# EAGLE design opd tester (EAGLE 9.5.2)
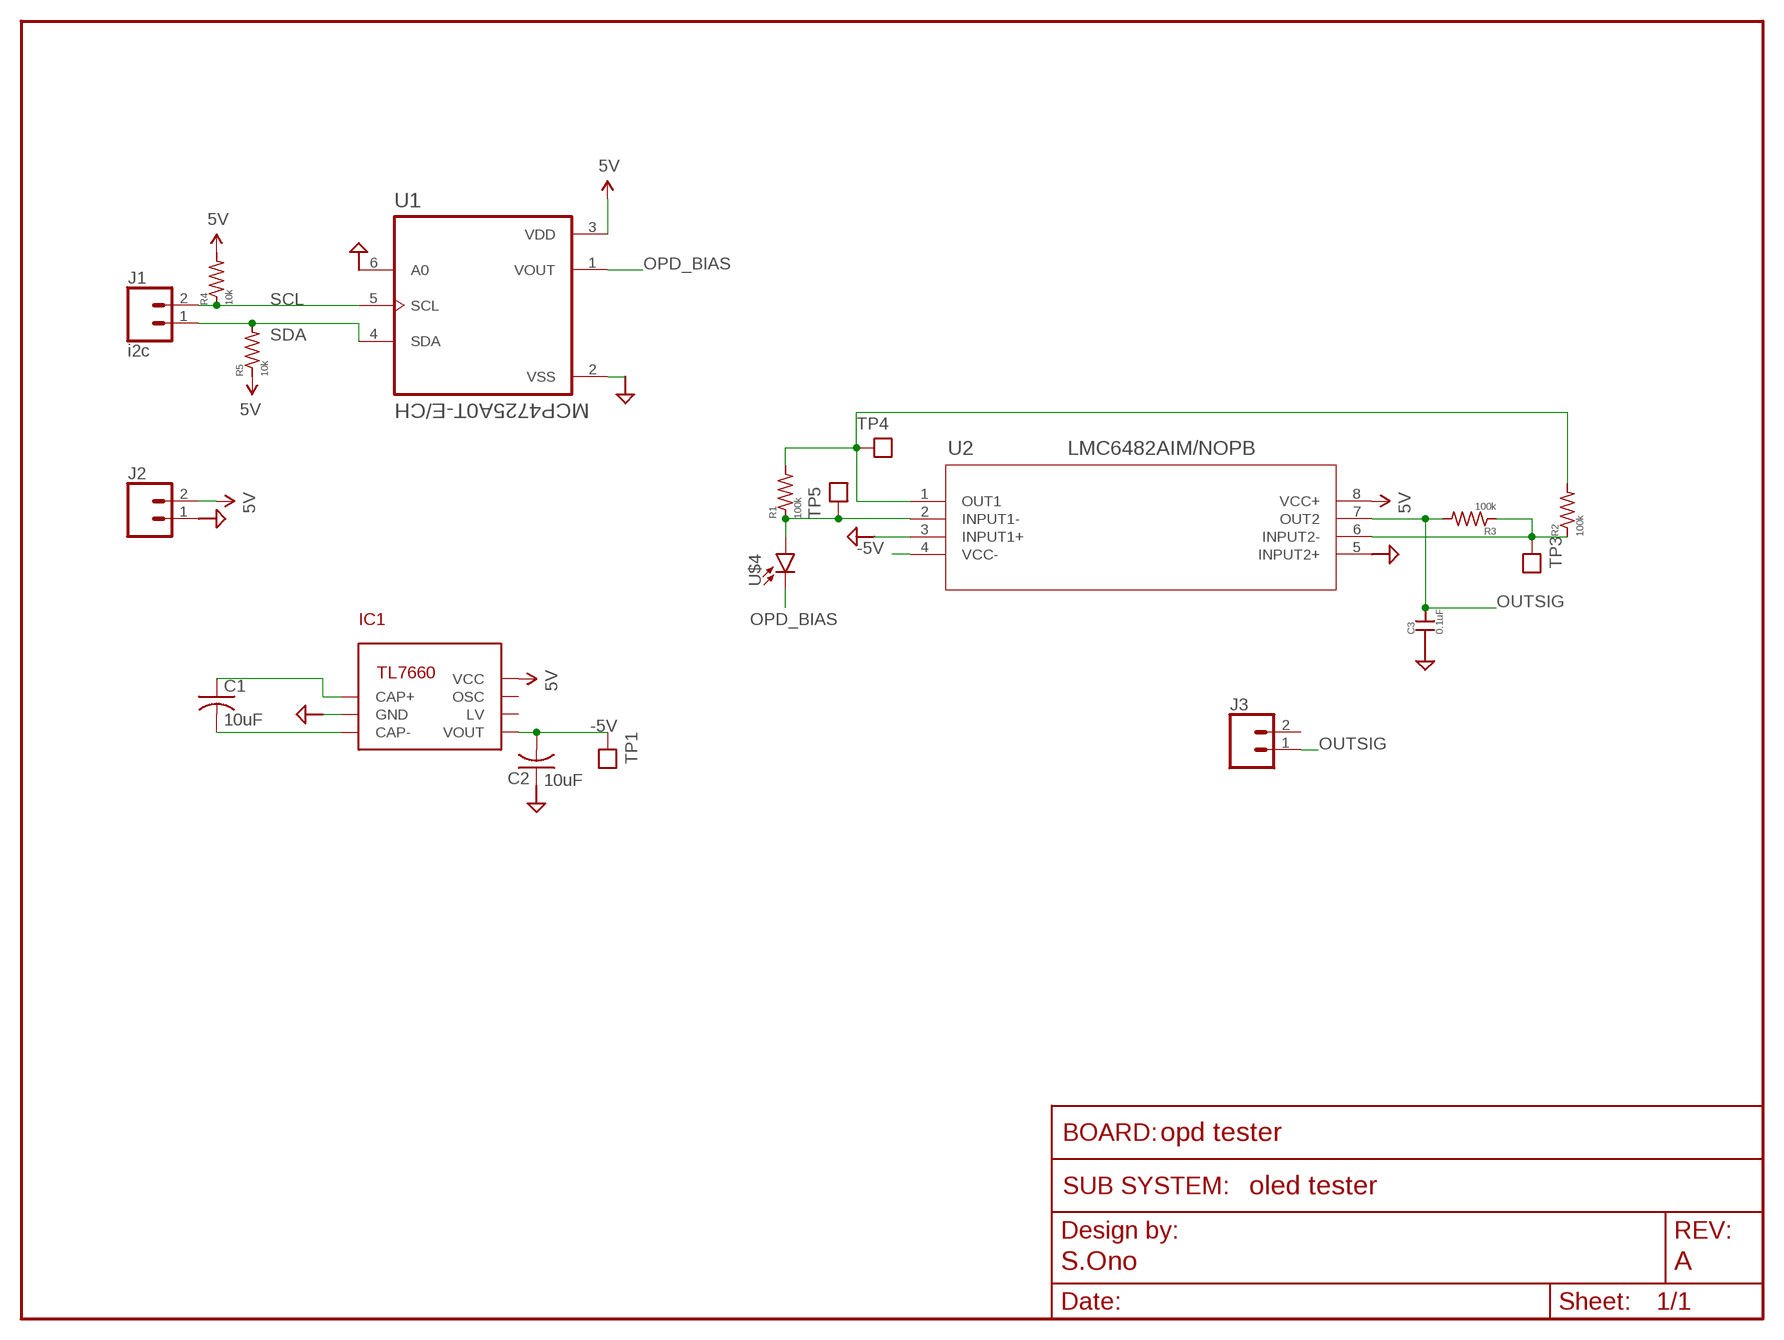
[diagram p0: schematic, sheet 1]
FRAME1 (FRAME_SCHEMATIC): AUTHOR: S.Ono; REV: A; SUBSYSTEM_NAME: oled tester

## Parts
C1  10uF  CAP_ELEC_3MM_SMD  [CAP_3MM]
C2  10uF  CAP_ELEC_3MM_SMD  [CAP_3MM]
C3  0.1uF  CAP0603-CAP  [0603-CAP]
IC1  TL7660  [8SOICW]
J1  i2c  CONN_02  [1X02]
J2  CONN_02  [1X02]
J3  CONN_02  [1X02]
R1  100k  R-US_0603  [0603-RES]
R2  100k  R-US_0603  [0603-RES]
R3  100k  R-US_0603  [0603-RES]
R4  10k  R-US_0603  [0603-RES]
R5  10k  R-US_0603  [0603-RES]
TP1  TEST_POINTTHRU  [TEST_POINT]
TP3  TEST_POINTTHRU  [TEST_POINT]
TP4  TEST_POINTTHRU  [TEST_POINT]
TP5  TEST_POINTTHRU  [TEST_POINT]
U1  MCP4725A0T-E/CH  [SOT95P270X145-6N]
U2  LMC6482AIM/NOPB  [M08A]
U$4  XDCR_SFH_229  [XDCR_SFH_229]

## Nets
5V: IC1.8(VCC) J2.2 R4.2 R5.1 U1.3(VDD) U2.8(VCC+)
-5V: C2.NEG IC1.5(VOUT) TP1.1 U2.4(VCC-)
GND: C2.POS C3.1 IC1.3(GND) J2.1 U1.2(VSS) U1.6(A0) U2.3(INPUT1+) U2.5(INPUT2+)
N$1: C1.POS IC1.2(CAP+)
N$2: C1.NEG IC1.4(CAP-)
N$3: R1.1 TP5.1 U2.2(INPUT1-) U$4.1(A)
N$4: R1.2 R2.2 TP4.1 U2.1(OUT1)
N$5: R2.1 R3.1 TP3.1 U2.6(INPUT2-)
OPD_BIAS: U1.1(VOUT) U$4.2(C)
OUTSIG: C3.2 J3.1 R3.2 U2.7(OUT2)
SCL: J1.2 R4.1 U1.5(SCL)
SDA: J1.1 R5.2 U1.4(SDA)
Unconnected: IC1.6(LV) IC1.7(OSC) J3.2

## Library data of the parts
C1 C2 = scono:CAP_ELEC: https://www.digikey.com/product-detail/en/nichicon/UWX1C100MCL2GB/493-2099-1-ND/590074
C3 = scono:CAP: Capacitor Standard 0603 ceramic capacitor, and 0.1" leaded capacitor.; PIE-INT-REF-NUM: CAPACITOR-GENERIC
IC1 = scono:TL7660: https://www.digikey.com/product-detail/en/texas-instruments/TL7660CDR/296-21856-1-ND/1629226
J1-J3 = scono:CONN_02: Multi connection point. Often used as Generic Header-pin footprint for 0.1 inch spaced/style header connections On any of the 0.1 inch spaced packages, you can populate with these: Break Away Headers - Straight <https://www.sparkfun.com/products/116> (PRT-00116) Break Away Male Headers - Right Angle <https://www.sparkfun.com/products/553> (PRT-00553) Female Headers <https://www.sparkfun.com/products/115> (PRT-00115) Break Away Headers - Machine Pin <https://www.sparkfun.com/products/117> (PRT-00117) Break Away Female Headers - Swiss Machine Pin <https://www.sparkfun.com/products/743> (PRT-00743) For SCREWTERMINALS and SPRING TERMINALS visit here: Screw Terimnals on SparkFun.com <https://www.sparkfun.com/search/results?term=Screw+Terminals> (5mm/3.5mm/2.54mm spacing) This device is also useful as a general connection point to wire up your design to another part of your project. Our various solder wires solder well into these plated through hole pads. Hook-Up Wire - Assortment (Stranded, 22 AWG) <https://www.sparkfun.com/products/11375> (PRT-11375) Hook-Up Wire - Assortment (Solid Core, 22 AWG) <https://www.sparkfun.com/products/11367> (PRT-11367) View the entire wire category on our website here <https://www.sparkfun.com/categories/141> Special notes: Molex polarized connector foot print use with: PRT-08233 with associated crimp pins and housings. 2.54_SCREWTERM for use with PRT-10571. 3.5mm Screw Terminal footprints for PRT-08084 5mm Screw Terminal footprints for use with PRT-08432
R1-R5 = scono:R-US_: RESISTOR, American symbol
TP1 TP3-TP5 = scono:TEST_POINT: 1206 Test point for O-scope probes. For A106146CT-ND or similar
U1 = scono:MCP4725A0T-E/CH: MCP4725 Series 1 Ch I2C EEPROM Memory 5.5 V 12-Bit D/A Converter SMT - SOT-23-6; DESCRIPTION: 12 Bit Digital to Analog Converter 1 SOT-23-6; DIGI-KEY_PART_NUMBER: MCP4725A0T-E/CHCT-ND; DIGI-KEY_PURCHASE_URL: https://www.digikey.com/product-detail/en/microchip-technology/MCP4725A0T-E-CH/MCP4725A0T-E-CHCT-ND/1817328?utm_source=snapeda&utm_medium=aggregator&utm_campaign=symbol; MF: Microchip; MP: MCP4725A0T-E/CH; PACKAGE: SOT-23-6 Microchip
U2 = scono:LMC6482AIM/NOPB; BUILT_BY: EMA_UL_Team; MANUFACTURER_PART_NUMBER: LMC6482AIM/NOPB; VENDOR: Texas Instruments
U$4 = scono:XDCR_SFH_229: Photodiode https://www.digikey.com/product-detail/en/osram-opto-semiconductors-inc/SFH-229/475-1078-ND/607287

## Board
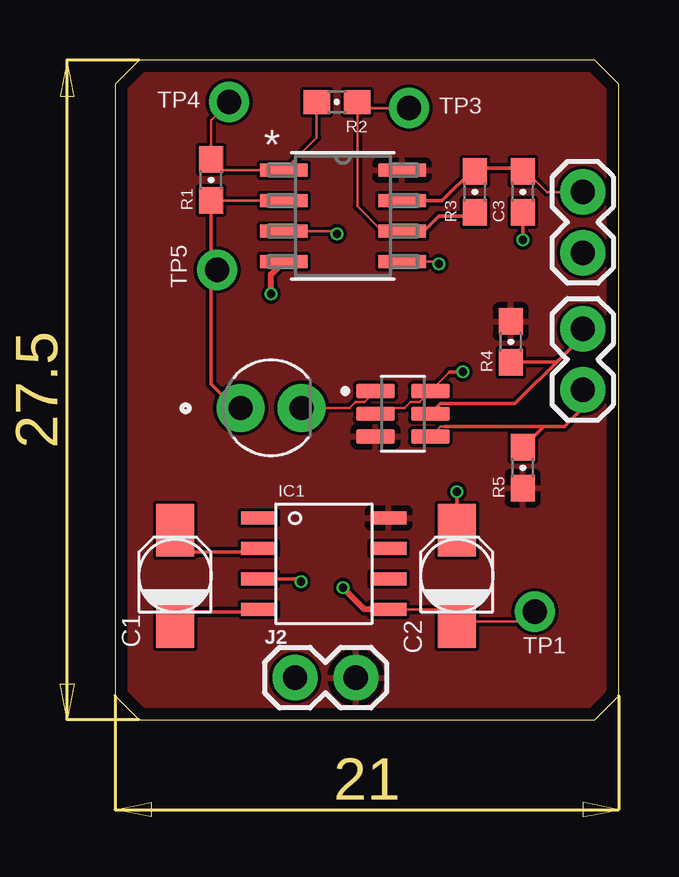
[diagram p1: board, top side]
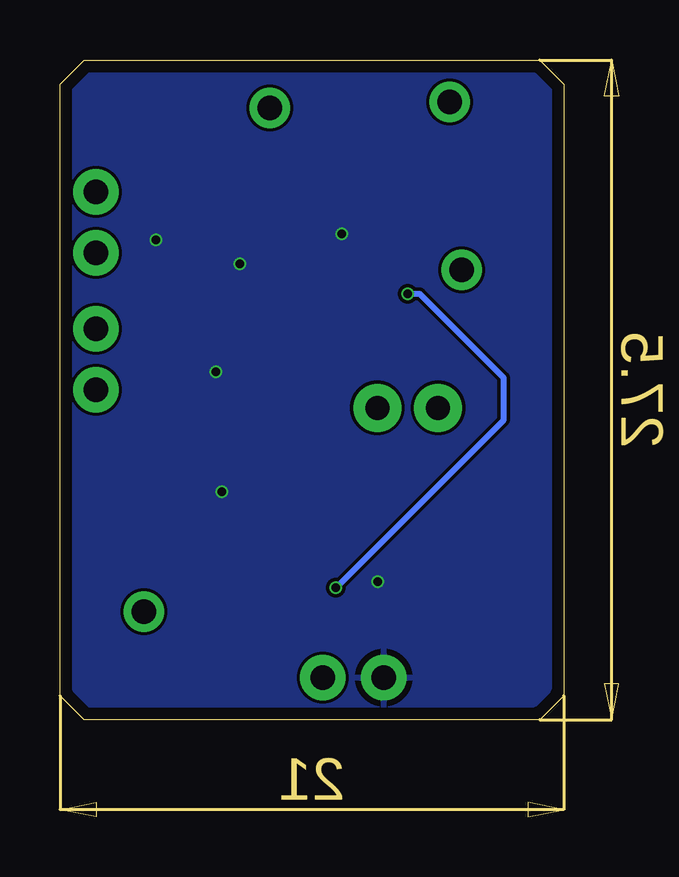
[diagram p2: board, bottom side, seen from below]

Size 21 x 27.5 mm. Coordinates in mm from the lower left corner, seen from the top.
Outline: 0,1 1,0 20,0 21,1 21,26.5 20,27.5 1,27.5 0,26.5 0,1
Copper layers (1*16): Top 2mil / dielectric 9mil / Bottom 2mil
Design rules "scono": minimum track width 3.5mil, minimum drill 0.2mm, track to track 5.5mil, track to pad 5.5mil, pad to pad 5.5mil, via to via 5.5mil, smd to smd 0mil, copper to edge 0.5mm, drill to drill 0.5mm, minimum pad ring 3mil, minimum via ring 3mil, stop-mask expansion 3mil, vias tented up to drill 0mil, thermal gap 10mil

### Footprints (pad centres in the part's own frame; a part is rotated, then mirrored left to right if it is on the bottom)
CAP_3MM = smd 1.6 x 2.2: NEG 0,-1.9; POS 0,1.9
0603-CAP = smd 1.1 x 1: 1 -0.85,0; 2 0.85,0
8SOICW = smd 0.55 x 1.5: 1 -1.905,0; 2 -0.635,0; 3 0.635,0; 4 1.905,0; 5 1.905,5.4; 6 0.635,5.4; 7 -0.635,5.4; 8 -1.905,5.4
1X02 = drill 1.016 pad 1.88: 1 0,0; 2 2.54,0
0603-RES = smd 1.1 x 1: 1 -0.85,0; 2 0.85,0
TEST_POINT = drill 1.016 pad 1.676: 1 0,0
SOT95P270X145-6N = smd 1.61 x 0.59: 1 -1.145,0.95; 2 -1.145,0; 3 -1.145,-0.95; 4 1.145,-0.95; 5 1.145,0; 6 1.145,0.95
M08A = smd 1.981 x 0.559: 1 -2.464,1.905; 2 -2.464,0.635; 3 -2.464,-0.635; 4 -2.464,-1.905; 5 2.464,-1.905; 6 2.464,-0.635; 7 2.464,0.635; 8 2.464,1.905
XDCR_SFH_229 = drill 1 pad 2: 1 -1.27,0; 2 1.27,0

### Placement (x,y rotation side)
C1  2.5,6 0 top
C2  14.25,6 0 top
C3  17,22 90 top
IC1  6,6.5 270 top
J1  19.5,13.75 90 top
J2  7.5,1.75 0 top
J3  19.5,22 270 top
R1  4,22.5 90 top
R2  9.25,25.75 180 top
R3  15,22 90 top
R4  16.5,15.75 90 top
R5  17,10.5 90 top
TP1  17.5,4.5 0 top
TP3  12.25,25.5 0 top
TP4  4.75,25.75 0 top
TP5  4.25,18.75 0 top
U1  12,12.75 0 top
U2  9.5,21 0 top
U$4  6.5,13 0 top

### Tracks (layer width: path | path; a pad name or v marks a point on that pad's centre or on a via)
5V
  pour Top: 0,34 31.5,34 31.5,-10.25 0,-10.25
-5V  (via drill 0.35)
  Top 0.1: 10.91,4.6 IC1.5 13.76,4.6 C2.NEG 17.1,4.1 TP1.1
  Top 0.254: IC1.5 10.41,4.6 v9.5,5.5 | v6.5,17.75 6.5,18.56 U2.4
  Bottom 0.254: v9.5,5.5 2.5,12.5 2.5,14.25 6,17.75 v6.5,17.75
GND  (via drill 0.35)
  Top 0.1: 13.95,14.5 U1.6 12.68,13.23 12.3,13.23 12.07,13 11.11,13 U1.2 | U2.5 13.4,19.09 v13.5,19 | U2.3 9.13,20.36 v9.25,20.25
  Top 0.152: C3.1 v17,20 | 13.95,14.5 v14.5,14.5 | C2.POS v14.25,9.5 | IC1.3 7.63,5.87 v7.75,5.75
  pour Bottom: 0,34 31.5,34 31.5,-10.5 0,-10.5
N$1
  Top 0.152: IC1.2 6,7 2.5,7 2.5,7.5 C1.POS
N$2
  Top 0.152: IC1.4 6,4.5 2.5,4.5 C1.NEG
N$3
  Top 0.1: R1.1 4.01,21.64 U2.2
  Top 0.152: 4,21.5 R1.1 4,21.5 | 4,21.5 4,19 TP5.1 4,18.5 4,14 5,13 U$4.1
N$4
  Top 0.1: TP4.1 4,25 4,23.25 | R1.2 4.45,22.91 U2.1 8.4,24.27 R2.2
  Top 0.152: 4,23.25 R1.2
N$5
  Top 0.1: 13,20.5 12.87,20.36 U2.6 11.13,20.36 10.1,21.4 R2.1 10.35,25.5 TP3.1
  Top 0.152: 13,20.5 13.5,21 15,21 R3.1
OPD_BIAS
  Top 0.1: U1.1 10.39,13.23 10.02,13.23 9.78,13 U$4.2
OUTSIG
  Top 0.1: J3.1 18,22 17,23
  Top 0.152: 15,23 17,23 C3.2 | 15,23 R3.2 15,23 | U2.7 13.63,21.64 15,23
SCL
  Top 0.152: J1.2 19.5,16 18.62,15.12 | U1.5 13.57,13.18 16.68,13.18 18.62,15.12 | R4.1 18.4,14.9 18.62,15.12
SDA
  Top 0.1: 13.73,12.23 13.57,12.23 U1.4
  Top 0.152: J1.1 19.5,13.5 19.5,13 18.73,12.23 | 18.73,12.23 13.73,12.23 | R5.2 17.88,12.23 18.73,12.23